# Altium project lab1_kochurin_usb_rs485.PrjPcb
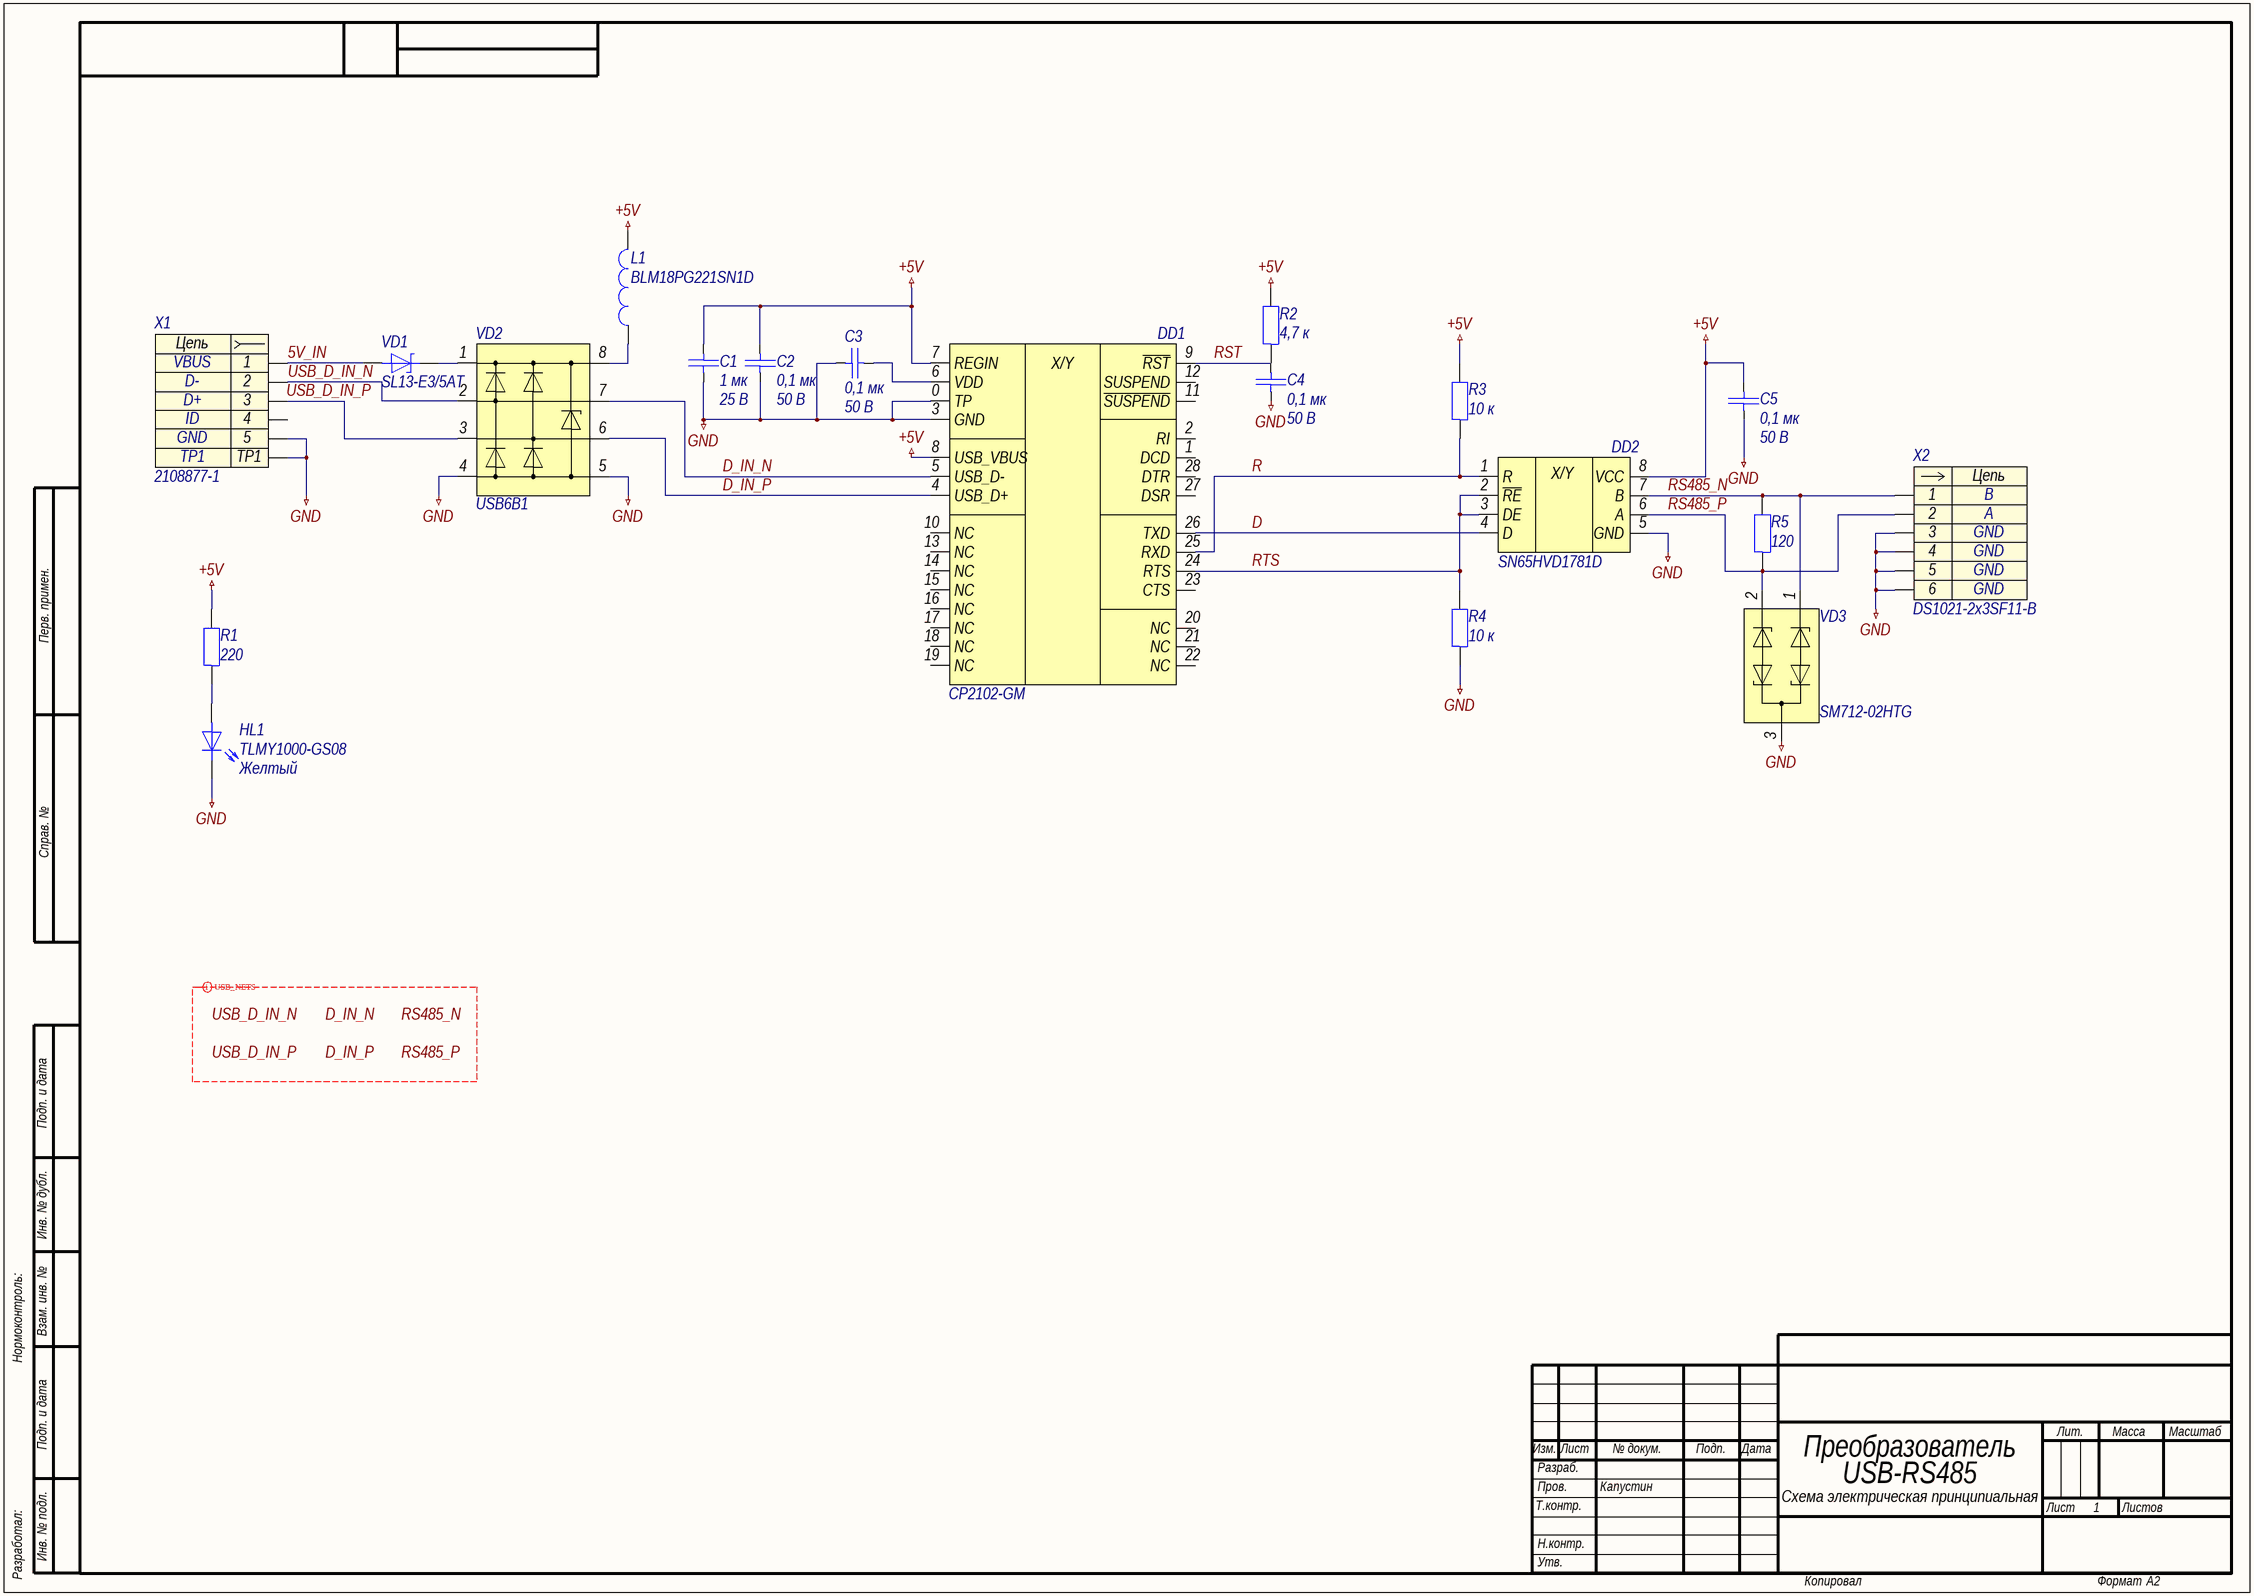
[diagram p0: lab1_kochurin_usb_rs485.SchDoc]
approver: Капустин; check: Капустин; designation: СПБПУ.3331506.013; developer: Кочурин; document_code: Ý3; document_type: Схема электрическая принципиальная; pcb_dec_number: СПБПУ.3331506.013; project: Лабораторная работа 1; sheets_total: 1; title: Преобразователь интерфейса USB-RS485; title_line_1: Преобразователь; title_line_2: USB-RS485
1 sheet, 19 parts. Net scope: global (net labels, ports and power ports of the same name join across sheets).
Board file: lab1_kochurin_usb_rs485.PcbDoc

## Sheet lab1_kochurin_usb_rs485.SchDoc: Преобразователь интерфейса USB-RS485
size 594 x 420 mm; ApprovedBy: Капустин; CheckedBy: Капустин; DrawnBy: Кочурин; DocumentNumber: СПБПУ.3331506.013Ý3; SheetNumber: 1; SheetTotal: 1; DocumentCode: Ý3; ImagePath: СПБПУ.3331506.013

### Parts
C1  1 мк  Напряжение: 25 В  [C0603]
C2  0,1 мк  Напряжение: 50 В  [C0603]
C3  0,1 мк  Напряжение: 50 В  [C0603]
C4  0,1 мк  Напряжение: 50 В  [C0603]
C5  0,1 мк  Напряжение: 50 В  [C0603]
DD1  CP2102-GM  [QFN-28-500X500X90]
DD2  SN65HVD1781D  [SOIC-8]
HL1  TLMY1000-GS08  Colour: Желтый  [HL0603]
L1  BLM18PG221SN1D  [BLM-2-0603]
R1  220  [R0603]
R2  4,7 к  [R0603]
R3  10 к  [R0603]
R4  10 к  [R0603]
R5  120  [R0603]
VD1  SL13-E3/5AT  [DO-214AC]
VD2  USB6B1  [SOIC-8]
VD3  SM712-02HTG  [SOT23-3]
X1  2108877-1  [2108877-1]
X2  DS1021-2x3SF11-B  [DS1021-2X3SF11-B]

### Nets
+5V: C1.2 C2.1 C5.1 DD1.7(REGIN) DD1.8(USB_VBUS) DD2.8(VCC) L1.2 R1.2 R2.2 R3.2
GND: C1.1 C2.2 C3.2 C4.2 C5.2 DD1.0(TP) DD1.3(GND) DD2.5(GND) HL1.1 R4.1 VD2.4 VD2.5 VD3.3 X1.5 X1.TP1 X2.3 X2.4 X2.5 X2.6
5V_IN: VD1.2 X1.1
D: DD1.26(TXD) DD2.4(D)
D_IN_N: DD1.5(USB_D-) VD2.7
D_IN_P: DD1.4(USB_D+) VD2.6
R: DD1.25(RXD) DD2.1(R) R3.1
RS485_N: DD2.7(B) R5.2 VD3.1 X2.1
RS485_P: DD2.6(A) R5.1 VD3.2 X2.2
RST: C4.1 DD1.9(~{RST}) R2.1
RTS: DD1.24(RTS) DD2.2(~{RE}) DD2.3(DE) R4.2
USB_D_IN_N: VD2.2 X1.2
NetC3_1: C3.1 DD1.6(VDD)
NetHL1_2: HL1.2 R1.1
NetL1_1: L1.1 VD2.8
NetVD1_1: VD1.1 VD2.1
NetVD2_3: VD2.3 X1.3

Not connected (* = marked no-connect by the designer): DD1 1(DCD) 2(RI) 10(NC) 11(~{SUSPEND}) 12(SUSPEND) 13(NC) 14(NC) 15(NC) 16(NC) 17(NC) 18(NC) 19(NC) 20(NC) 21(NC) 22(NC) 23(CTS) 27(DSR) 28(DTR); X1 4

### Layout directives
differential pair; differential pair class USB_SIGNALS; rule Differential Pairs Routing [Pref Gap = 0.15mm    Min Gap  = 0.15mm    Max Gap  = 0.15mmPref Width = 0.188mm    Min Width  = 0.188mm    Max Width  = 0.188mm]: D_IN_N, D_IN_P, RS485_N, RS485_P, USB_D_IN_N, USB_D_IN_P

### Notes on the sheet
- Labels drawn without touching a wire or pin: D_IN_N, D_IN_P, RS485_N, RS485_P, USB_D_IN_N, USB_D_IN_P
- Перв. примен.
- Справ. №
- Подп. и дата
- Инв. № дубл.
- Нормоконтроль:
- Взам. инв. №
- Изм.
- Лист
- № докум.
- Подп.
- Дата
- Лит.
- Масса
- Масштаб
- Т.контр.
- Пров.
- Разраб.
- Листов
- Разработал:
- Инв. № подл.
- Н.контр.
- Утв.
- Копировал
- Формат
- А2
- (in symbol dd0002) X/Y
- (in symbol dd0010) X/Y
- (in symbol x0001) Цепь
- (in symbol x0015) Цепь

### Library data of the parts
C1 = c0008: =Описание; ID: c0008; Фамилия: Ларионов; Описание: Конденсатор чип 0603 1 мкФ 25 В ±10 %; Наименование: CC0603KRX7R8BB105; Производитель: YAGEO Corp.; Отклонение: ±10 %; Рабочие температуры: от -55 °С до +125 °С; Корпус: 0603; Номинал: 1 мк; Номинальное напряжение: 25 В; HelpURL: https://www.yageo.com/upload/media/product/products/datasheet/mlcc/UPY-GPHC_X7R_6.3V-to-50V_20.pdf
C2-C5 = c0005: =Описание; ID: c0005; Фамилия: Ларионов; Описание: Конденсатор чип 0603 0,1 мкФ 50 В ±5 %; Наименование: CC0603JRX7R9BB104; Производитель: YAGEO Corp.; Отклонение: ±5 %; Рабочие температуры: от -55 °С до +125 °С; Корпус: 0603; Номинал: 0,1 мк; Номинальное напряжение: 50 В; HelpURL: https://www.yageo.com/upload/media/product/products/datasheet/mlcc/UPY-GPHC_X7R_6.3V-to-50V_20.pdf
DD1 = dd0002: =Описание; ID: dd0002; Фамилия: Кочурин; Описание: Преобразователь USB-UART; Производитель: Silicon Laboratories; Корпус: QFN-28; Наименование: CP2102-GM; HelpURL: https://www.silabs.com/interface/usb-bridges/classic/device.cp2102
DD2 = dd0010: =Описание; ID: dd0010; Фамилия: Кочурин; Описание: Приемопередатчик RS-485; Производитель: Texas Instruments; Наименование: SN65HVD1781D; Корпус: SOIC-8; HelpURL: https://www.ti.com/product/SN65HVD1781
HL1 = hl0003: =Описание; ID: hl0003; Фамилия: Ларионов; Описание: Светодиод чип 0603 желтый; Производитель: Vishay Intertechnology, Inc.; Номинальная сила света: 7,5 мкд; Номинальная длина волны: 588 нм; Номинальный прямой ток: 15 мА; Номинальное падение напряжения: 1,8 В; Рассеиваемая мощность: 40 мВт; Рабочие температуры: от –40 °С до +100 °С; Корпус: 0603; Наименование: TLMY1000-GS08; Цвет: Желтый; HelpURL: https://www.vishay.com/leds/list/product-83172/
L1 = l0002: =Описание; ID: l0002; Фамилия: Самарин; Описание: Ферритовая бусина 220 Ом ±25 %; Производитель: Murata Manufacturing Co., Ltd.; Сопротивление, 100 МГц: 220 Ом; Отклонение, 100 Мгц: ±25 %; Сопротивление при постоянном токе: 0,1 Ом; Рабочие температуры: от -55 °С до +125 °С; Корпус: 0603; Наименование: BLM18PG221SN1D; HelpURL: https://www.murata.com/en-global/products/productdetail?partno=BLM18PG221SN1%23
R1 = r0008: =Описание; ID: r0008; Фамилия: Ларионов; Описание: Резистор чип 0603 220 Ом ±1 % 0,1 Вт; Наименование: RC0603FR-07220RL; Производитель: YAGEO Corp.; Отклонение: ±1 %; Номинальное напряжение: 75 В; Рабочие температуры: от -55 °С до +155 °С; Номинальный ток: 1 А; Корпус: 0603; Номинал: 220; HelpURL: https://www.yageo.com/upload/media/product/productsearch/datasheet/rchip/PYu-RC_Group_51_RoHS_L_11.pdf
R2 = r0011: =Описание; ID: r0011; Фамилия: Ларионов; Описание: Резистор чип 0603 4,7 кОм ±1 % 0,1 Вт; Наименование: RC0603FR-074K7L; Производитель: YAGEO Corp.; Отклонение: ±1 %; Номинальное напряжение: 75 В; Рабочие температуры: от -55 °С до +155 °С; Номинальный ток: 1 А; Корпус: 0603; Номинал: 4,7 к; HelpURL: https://www.yageo.com/upload/media/product/productsearch/datasheet/rchip/PYu-RC_Group_51_RoHS_L_11.pdf
R3 R4 = r0012: =Описание; ID: r0012; Фамилия: Самарин; Описание: Резистор чип 0603 10 кОм ±1 % 0,1 Вт; Наименование: RC0603FR-0710KL; Производитель: YAGEO Corp.; Отклонение: ±1 %; Номинальное напряжение: 75 В; Рабочие температуры: от -55 °С до +155 °С; Номинальный ток: 1 А; Корпус: 0603; Номинал: 10 к; HelpURL: https://www.yageo.com/upload/media/product/productsearch/datasheet/rchip/PYu-RC_Group_51_RoHS_L_11.pdf
R5 = r0007: =Описание; ID: r0007; Фамилия: Самарин; Описание: Резистор чип 0603 120 Ом ±1 % 0,1 Вт; Наименование: RC0603FR‍‐07120RL; Производитель: YAGEO Corp.; Отклонение: ±1 %; Номинальное напряжение: 75 В; Рабочие температуры: от -55 °С до +155 °С; Номинальный ток: 1 А; Корпус: 0603; Номинал: 120; HelpURL: https://www.yageo.com/upload/media/product/productsearch/datasheet/rchip/PYu-RC_Group_51_RoHS_L_11.pdf
VD1 = vd0003: =Описание; ID: vd0003; Фамилия: Ларионов; Описание: Диод Шоттки 30 В 1,5 А; Производитель: Vishay Intertechnology, Inc.; Максимальное прямое напряжение: 0,445 В; Максимальное обратное напряжение: 30 В; Максимальный прямой ток: 1,5 А; Рабочие температуры: от –55 °С до +125 °С; Наименование: SL13-E3/5AT; Корпус: DO-214AC; HelpURL: https://www.vishay.com/product?docid=88740
VD2 = vd0010: =Описание; ID: vd0010; Фамилия: Ларионов; Описание: Диодная сборка для подавления помех, от 6 В; Производитель: STMicroelectronics; Наименование: USB6B1; Корпус: SOIC-8; HelpURL: https://www.st.com/content/st_com/en/products/protection-devices/esd-protection/usb-port-protection/usb6b1.html
VD3 = vd0003: =Описание; ID: vd0003; Фамилия: Самарин; Описание: Диодная сборка для подавления помех, -7/12 В; Производитель: Littelfuse, Inc.; Наименование: SM712-02HTG; Корпус: SOT23-3; HelpURL: https://www.littelfuse.com/products/tvs-diode-arrays/general-purpose-esd-protection/sm712.aspx
X1 = x0001: =Описание; Contact_1: VBUS; Contact_2: D-; Contact_3: D+; Contact_4: ID; Contact_5: GND; ID: x0001; Фамилия: Ларионов; Описание: Micro USB 2.0 Type B IP68 гнездо; Производитель: TE Connectivity; Наименование: 2108877-1; HelpURL: https://www.te.com/global-en/product-2108877-1.html
X2 = x0015: =Описание; Contact_1: B; Contact_2: A; Contact_3: GND; ID: x0015; Фамилия: Самарин; Описание: PLS 2x3 pin 2,54 мм вилка прямой; Производитель: Connfly Electronic Co., Ltd.; Contact_4: GND; Contact_5: GND; Contact_6: GND; Наименование: DS1021-2x3SF11-B; HelpURL: http://en.connfly.group/product/xVkr=EusQssAN0gN=Aos=mU+UrVkR9kqEAN0gN9g+WqANB+A